# Altium schematic sheet 03)CPU-3.SchDoc
size 297 x 209 mm
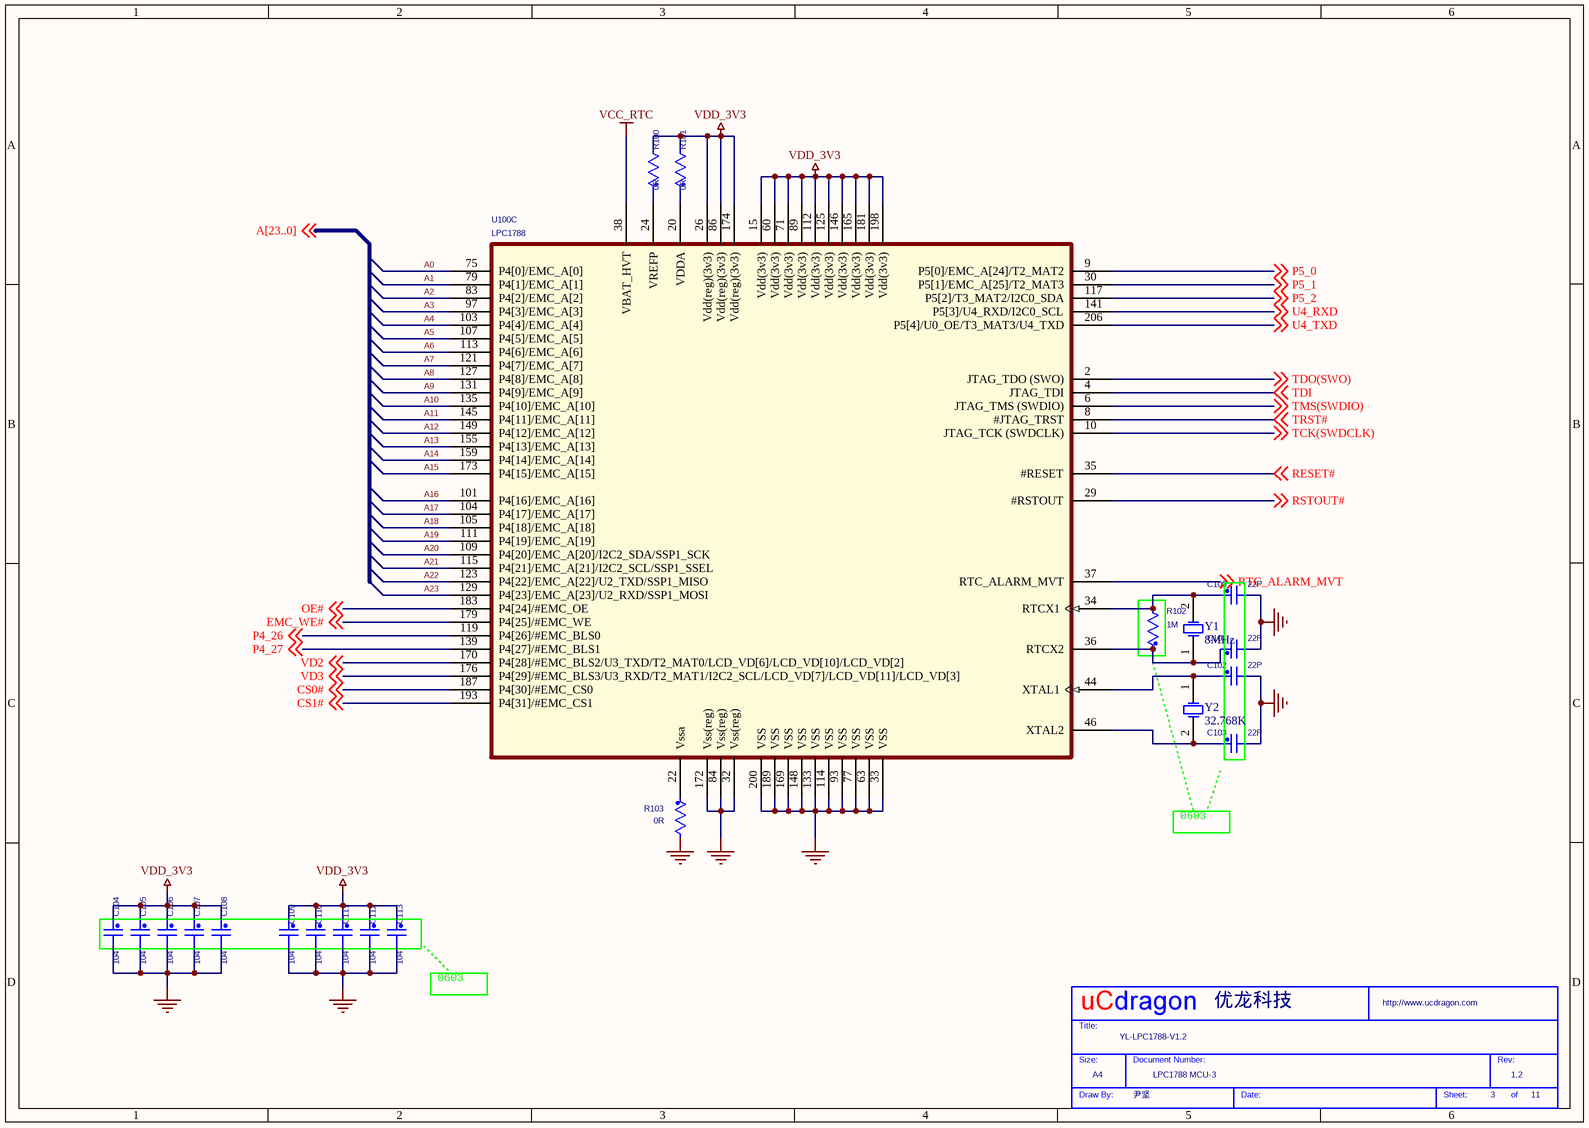
[diagram p0: 03)CPU-3.SchDoc]

## Parts
*  Page Count: 11  Page Number: 3  Page Size: A4  Title: YL-LPC1788-V1.2  RevCode: 1.2  Doc: LPC1788 MCU-3  Drawing: 尹坚  Company: 优龙科技  (hidden comment: My Title 0)  (graphical)
C100  22P  [0603P]
C101  22P  [0603P]
C102  22P  [0603P]
C103  22P  [0603P]
C104  104  [0603P]
C105  104  [0603P]
C106  104  [0603P]
C107  104  [0603P]
C108  104  [0603P]
C109  104  [0603P]
C110  104  [0603P]
C111  104  [0603P]
C112  104  [0603P]
C113  104  [0603P]
R100  0R  [0603P]
R101  0R  [0603P]
R102  1M  [0603P]
R103  0R  [0603P]
U100  LPC1788  [LQFP208_28X28X05P]  (part C of 3)
Y1  8MHz  [SMD2_50X32]
Y2  32.768K  [XTAL32]

## Nets
GND_POWER: C100.2 C101.2 C102.2 C103.2 C104.2 C105.2 C106.2 C107.2 C108.2 C109.2 C110.2 C111.2 C112.2 C113.2 R103.2 U100.32(Vss(reg)) U100.33(VSS) U100.63(VSS) U100.77(VSS) U100.84(Vss(reg)) U100.93(VSS) U100.114(VSS) U100.133(VSS) U100.148(VSS) U100.169(VSS) U100.172(Vss(reg)) U100.189(VSS) U100.200(VSS)
VCC_RTC: U100.38(VBAT_HVT)
VDD_3V3: C104.1 C105.1 C106.1 C107.1 C108.1 C109.1 C110.1 C111.1 C112.1 C113.1 R100.2 R101.2 U100.15(Vdd(3v3)) U100.26(Vdd(reg)(3v3)) U100.60(Vdd(3v3)) U100.71(Vdd(3v3)) U100.86(Vdd(reg)(3v3)) U100.89(Vdd(3v3)) U100.112(Vdd(3v3)) U100.125(Vdd(3v3)) U100.146(Vdd(3v3)) U100.165(Vdd(3v3)) U100.174(Vdd(reg)(3v3)) U100.181(Vdd(3v3)) U100.198(Vdd(3v3))
A0: U100.75(P4[0]/EMC_A[0])
A1: U100.79(P4[1]/EMC_A[1])
A2: U100.83(P4[2]/EMC_A[2])
A3: U100.97(P4[3]/EMC_A[3])
A4: U100.103(P4[4]/EMC_A[4])
A5: U100.107(P4[5]/EMC_A[5])
A6: U100.113(P4[6]/EMC_A[6])
A7: U100.121(P4[7]/EMC_A[7])
A8: U100.127(P4[8]/EMC_A[8])
A9: U100.131(P4[9]/EMC_A[9])
A10: U100.135(P4[10]/EMC_A[10])
A11: U100.145(P4[11]/EMC_A[11])
A12: U100.149(P4[12]/EMC_A[12])
A13: U100.155(P4[13]/EMC_A[13])
A14: U100.159(P4[14]/EMC_A[14])
A15: U100.173(P4[15]/EMC_A[15])
A16: U100.101(P4[16]/EMC_A[16])
A17: U100.104(P4[17]/EMC_A[17])
A18: U100.105(P4[18]/EMC_A[18])
A19: U100.111(P4[19]/EMC_A[19])
A20: U100.109(P4[20]/EMC_A[20]/I2C2_SDA/SSP1_SCK)
A21: U100.115(P4[21]/EMC_A[21]/I2C2_SCL/SSP1_SSEL)
A22: U100.123(P4[22]/EMC_A[22]/U2_TXD/SSP1_MISO)
A23: U100.129(P4[23]/EMC_A[23]/U2_RXD/SSP1_MOSI)
CS0#: U100.187(P4[30]/#EMC_CS0) ; off-sheet CS0#
CS1#: U100.193(P4[31]/#EMC_CS1) ; off-sheet CS1#
EMC_WE#: U100.179(P4[25]/#EMC_WE) ; off-sheet EMC_WE#
OE#: U100.183(P4[24]/#EMC_OE) ; off-sheet OE#
P4_26: U100.119(P4[26]/#EMC_BLS0) ; off-sheet P4_26
P4_27: U100.139(P4[27]/#EMC_BLS1) ; off-sheet P4_27
P5_0: U100.9(P5[0]/EMC_A[24]/T2_MAT2) ; off-sheet P5_0
P5_1: U100.30(P5[1]/EMC_A[25]/T2_MAT3) ; off-sheet P5_1
P5_2: U100.117(P5[2]/T3_MAT2/I2C0_SDA) ; off-sheet P5_2
RESET#: U100.35(#RESET) ; off-sheet RESET#
RSTOUT#: U100.29(#RSTOUT) ; off-sheet RSTOUT#
RTC_ALARM_MVT: U100.37(RTC_ALARM_MVT) ; off-sheet RTC_ALARM_MVT
TCK(SWDCLK): U100.10(JTAG_TCK_(SWDCLK)) ; off-sheet TCK(SWDCLK)
TDI: U100.4(JTAG_TDI) ; off-sheet TDI
TDO(SWO): U100.2(JTAG_TDO_(SWO)) ; off-sheet TDO(SWO)
TMS(SWDIO): U100.6(JTAG_TMS_(SWDIO)) ; off-sheet TMS(SWDIO)
TRST#: U100.8(#JTAG_TRST) ; off-sheet TRST#
U4_RXD: U100.141(P5[3]/U4_RXD/I2C0_SCL) ; off-sheet U4_RXD
U4_TXD: U100.206(P5[4]/U0_OE/T3_MAT3/U4_TXD) ; off-sheet U4_TXD
VD2: U100.170(P4[28]/#EMC_BLS2/U3_TXD/T2_MAT0/LCD_VD[6]/LCD_VD[10]/LCD_VD[2]) ; off-sheet VD2
VD3: U100.176(P4[29]/#EMC_BLS3/U3_RXD/T2_MAT1/I2C2_SCL/LCD_VD[7]/LCD_VD[11]/LCD_VD[3]) ; off-sheet VD3
NetC100_1: C100.1 R102.2 U100.34(RTCX1) Y1.2(OSC2)
NetC101_1: C101.1 R102.1 U100.36(RTCX2) Y1.1(OSC1)
NetC102_1: C102.1 U100.44(XTAL1) Y2.1(OSC1)
NetC103_1: C103.1 U100.46(XTAL2) Y2.2(OSC2)
NetR100_1: R100.1 U100.24(VREFP)
NetR101_1: R101.1 U100.20(VDDA)
NetR103_1: R103.1 U100.22(Vssa)

## Notes on the sheet
- 0603
- (in symbol My Title 0) Title:; Size:; Document Number:; Rev:; Draw By:; Date:; Sheet:; of

## Library data of the parts
C100-C113 = C_Generic_Dup2
R100-R103 = R_Generic_Dup2
Y1 = XTAL: Crystal Oscillator; Published: 8-Jun-2000; LatestRevisionDate: 17-Jul-2002; LatestRevisionNote: Re-released for DXP Platform.; Publisher: Altium Limited
Y2 = XTAL_1: Crystal Oscillator; Published: 8-Jun-2000; LatestRevisionDate: 17-Jul-2002; LatestRevisionNote: Re-released for DXP Platform.; Publisher: Altium Limited
* = My Title 0: Page Create Date: May 29, 2006; WebSite: http://www.ucdragon.com